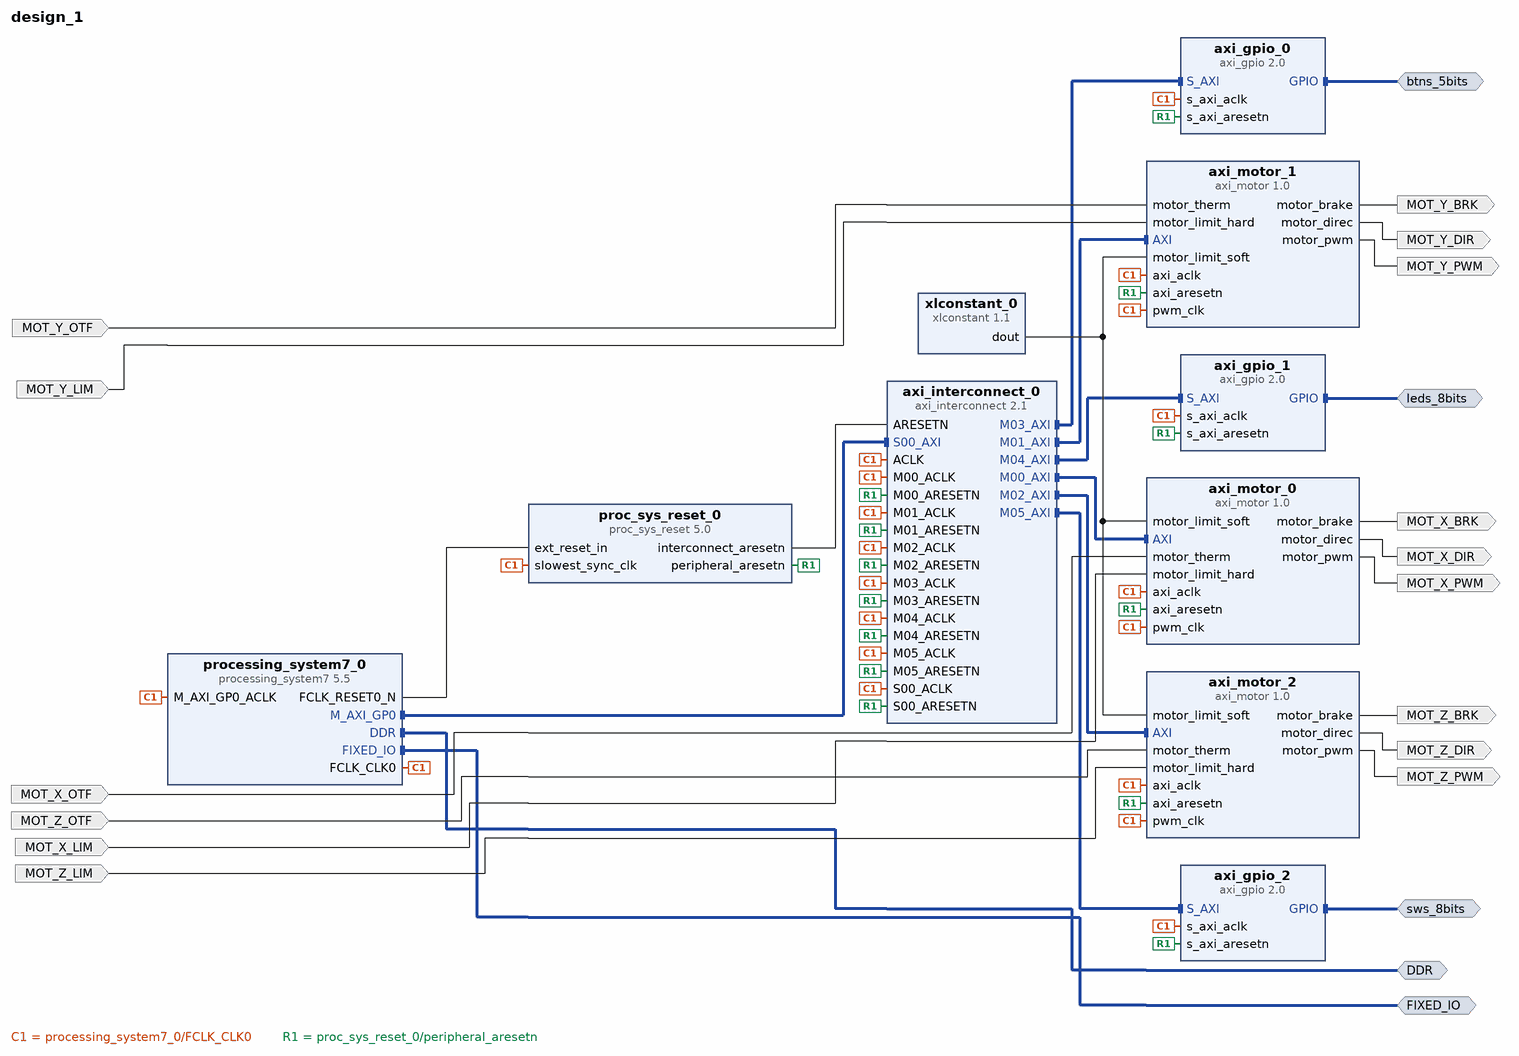
[diagram p0: block diagram of the top level]
# Vivado block design design_1, xc7z020clg484-1, Vivado 2017.2
create_bd_design design_1

create_bd_intf_port -mode Master -vlnv xilinx.com:interface:ddrx_rtl:1.0 DDR
create_bd_intf_port -mode Master -vlnv xilinx.com:display_processing_system7:fixedio_rtl:1.0 FIXED_IO
create_bd_intf_port -mode Master -vlnv xilinx.com:interface:gpio_rtl:1.0 btns_5bits
create_bd_intf_port -mode Master -vlnv xilinx.com:interface:gpio_rtl:1.0 leds_8bits
create_bd_intf_port -mode Master -vlnv xilinx.com:interface:gpio_rtl:1.0 sws_8bits
create_bd_port -dir O MOT_Y_PWM
create_bd_port -dir O MOT_Y_BRK
create_bd_port -dir O MOT_X_PWM
create_bd_port -dir O MOT_X_BRK
create_bd_port -dir O MOT_Z_PWM
create_bd_port -dir O MOT_Z_BRK
create_bd_port -dir I MOT_X_OTF
create_bd_port -dir I MOT_Y_OTF
create_bd_port -dir I MOT_Z_OTF
create_bd_port -dir O MOT_X_DIR
create_bd_port -dir O MOT_Y_DIR
create_bd_port -dir O MOT_Z_DIR
create_bd_port -dir I MOT_X_LIM
create_bd_port -dir I MOT_Y_LIM
create_bd_port -dir I MOT_Z_LIM

create_bd_cell -type ip -vlnv xilinx.com:ip:processing_system7:5.5 processing_system7_0
set_property -dict {CONFIG.preset ZedBoard} [get_bd_cells processing_system7_0]
create_bd_cell -type ip -vlnv xilinx.com:ip:proc_sys_reset:5.0 proc_sys_reset_0
create_bd_cell -type ip -vlnv xilinx.com:ip:axi_interconnect:2.1 axi_interconnect_0
set_property -dict {CONFIG.NUM_MI 6} [get_bd_cells axi_interconnect_0]
create_bd_cell -type ip -vlnv xilinx.com:ip:axi_gpio:2.0 axi_gpio_0
set_property -dict [list \
  CONFIG.C_IS_DUAL 0 \
  CONFIG.USE_BOARD_FLOW true \
  CONFIG.GPIO_BOARD_INTERFACE btns_5bits \
  CONFIG.GPIO2_BOARD_INTERFACE Custom \
] [get_bd_cells axi_gpio_0]
create_bd_cell -type ip -vlnv xilinx.com:ip:axi_gpio:2.0 axi_gpio_1
set_property -dict {CONFIG.USE_BOARD_FLOW true CONFIG.GPIO_BOARD_INTERFACE leds_8bits} [get_bd_cells axi_gpio_1]
create_bd_cell -type ip -vlnv xilinx.com:ip:axi_gpio:2.0 axi_gpio_2
set_property -dict {CONFIG.USE_BOARD_FLOW true CONFIG.GPIO_BOARD_INTERFACE sws_8bits} [get_bd_cells axi_gpio_2]
create_bd_cell -type ip -vlnv xilinx.com:ip:xlconstant:1.1 xlconstant_0
set_property -dict {CONFIG.CONST_VAL 0} [get_bd_cells xlconstant_0]
create_bd_cell -type ip -vlnv user.edu:Crane:axi_motor:1.0 axi_motor_0
set_property -dict {CONFIG.NUM_MOTOR_LIMIT_FLAGS 1} [get_bd_cells axi_motor_0]
create_bd_cell -type ip -vlnv user.edu:Crane:axi_motor:1.0 axi_motor_1
set_property -dict {CONFIG.NUM_MOTOR_LIMIT_FLAGS 1} [get_bd_cells axi_motor_1]
create_bd_cell -type ip -vlnv user.edu:Crane:axi_motor:1.0 axi_motor_2
set_property -dict {CONFIG.NUM_MOTOR_LIMIT_FLAGS 1} [get_bd_cells axi_motor_2]

# ---- connections ----

connect_bd_intf_net [get_bd_intf_pins processing_system7_0/M_AXI_GP0] [get_bd_intf_pins axi_interconnect_0/S00_AXI]
connect_bd_intf_net [get_bd_intf_pins axi_motor_0/AXI] [get_bd_intf_pins axi_interconnect_0/M00_AXI]
connect_bd_intf_net [get_bd_intf_pins axi_motor_1/AXI] [get_bd_intf_pins axi_interconnect_0/M01_AXI]
connect_bd_intf_net [get_bd_intf_pins axi_motor_2/AXI] [get_bd_intf_pins axi_interconnect_0/M02_AXI]
connect_bd_intf_net [get_bd_intf_pins axi_gpio_0/S_AXI] [get_bd_intf_pins axi_interconnect_0/M03_AXI]
connect_bd_intf_net [get_bd_intf_pins axi_gpio_1/S_AXI] [get_bd_intf_pins axi_interconnect_0/M04_AXI]
connect_bd_intf_net [get_bd_intf_pins axi_gpio_2/S_AXI] [get_bd_intf_pins axi_interconnect_0/M05_AXI]
connect_bd_intf_net [get_bd_intf_ports DDR] [get_bd_intf_pins processing_system7_0/DDR]
connect_bd_intf_net [get_bd_intf_ports FIXED_IO] [get_bd_intf_pins processing_system7_0/FIXED_IO]
connect_bd_intf_net [get_bd_intf_ports btns_5bits] [get_bd_intf_pins axi_gpio_0/GPIO]
connect_bd_intf_net [get_bd_intf_ports leds_8bits] [get_bd_intf_pins axi_gpio_1/GPIO]
connect_bd_intf_net [get_bd_intf_ports sws_8bits] [get_bd_intf_pins axi_gpio_2/GPIO]
connect_bd_net [get_bd_pins processing_system7_0/FCLK_CLK0] \
  [get_bd_pins proc_sys_reset_0/slowest_sync_clk] [get_bd_pins processing_system7_0/M_AXI_GP0_ACLK] \
  [get_bd_pins axi_gpio_0/s_axi_aclk] [get_bd_pins axi_gpio_1/s_axi_aclk] [get_bd_pins axi_gpio_2/s_axi_aclk] \
  [get_bd_pins axi_interconnect_0/ACLK] [get_bd_pins axi_interconnect_0/S00_ACLK] [get_bd_pins axi_interconnect_0/M00_ACLK] \
  [get_bd_pins axi_interconnect_0/M01_ACLK] [get_bd_pins axi_interconnect_0/M02_ACLK] \
  [get_bd_pins axi_interconnect_0/M03_ACLK] [get_bd_pins axi_interconnect_0/M04_ACLK] \
  [get_bd_pins axi_interconnect_0/M05_ACLK] [get_bd_pins axi_motor_0/pwm_clk] [get_bd_pins axi_motor_0/axi_aclk] \
  [get_bd_pins axi_motor_1/pwm_clk] [get_bd_pins axi_motor_1/axi_aclk] [get_bd_pins axi_motor_2/pwm_clk] \
  [get_bd_pins axi_motor_2/axi_aclk]
connect_bd_net [get_bd_pins proc_sys_reset_0/interconnect_aresetn] [get_bd_pins axi_interconnect_0/ARESETN]
connect_bd_net [get_bd_pins proc_sys_reset_0/peripheral_aresetn] \
  [get_bd_pins axi_gpio_0/s_axi_aresetn] [get_bd_pins axi_gpio_2/s_axi_aresetn] [get_bd_pins axi_gpio_1/s_axi_aresetn] \
  [get_bd_pins axi_interconnect_0/S00_ARESETN] [get_bd_pins axi_interconnect_0/M00_ARESETN] \
  [get_bd_pins axi_interconnect_0/M01_ARESETN] [get_bd_pins axi_interconnect_0/M02_ARESETN] \
  [get_bd_pins axi_interconnect_0/M03_ARESETN] [get_bd_pins axi_interconnect_0/M05_ARESETN] \
  [get_bd_pins axi_interconnect_0/M04_ARESETN] [get_bd_pins axi_motor_0/axi_aresetn] [get_bd_pins axi_motor_1/axi_aresetn] \
  [get_bd_pins axi_motor_2/axi_aresetn]
connect_bd_net [get_bd_pins processing_system7_0/FCLK_RESET0_N] [get_bd_pins proc_sys_reset_0/ext_reset_in]
connect_bd_net [get_bd_pins axi_motor_1/motor_pwm] [get_bd_ports MOT_Y_PWM]
connect_bd_net [get_bd_pins axi_motor_1/motor_brake] [get_bd_ports MOT_Y_BRK]
connect_bd_net [get_bd_pins axi_motor_0/motor_pwm] [get_bd_ports MOT_X_PWM]
connect_bd_net [get_bd_pins axi_motor_0/motor_brake] [get_bd_ports MOT_X_BRK]
connect_bd_net [get_bd_pins axi_motor_2/motor_pwm] [get_bd_ports MOT_Z_PWM]
connect_bd_net [get_bd_pins axi_motor_2/motor_brake] [get_bd_ports MOT_Z_BRK]
connect_bd_net -net motor_therm_1 [get_bd_ports MOT_X_OTF] [get_bd_pins axi_motor_0/motor_therm]
connect_bd_net -net motor_therm_2 [get_bd_ports MOT_Y_OTF] [get_bd_pins axi_motor_1/motor_therm]
connect_bd_net -net motor_therm_3 [get_bd_ports MOT_Z_OTF] [get_bd_pins axi_motor_2/motor_therm]
connect_bd_net [get_bd_pins axi_motor_0/motor_direc] [get_bd_ports MOT_X_DIR]
connect_bd_net [get_bd_pins axi_motor_1/motor_direc] [get_bd_ports MOT_Y_DIR]
connect_bd_net [get_bd_pins axi_motor_2/motor_direc] [get_bd_ports MOT_Z_DIR]
connect_bd_net -net motor_limit_hard_1 [get_bd_ports MOT_X_LIM] [get_bd_pins axi_motor_0/motor_limit_hard]
connect_bd_net -net motor_limit_hard_2 [get_bd_ports MOT_Y_LIM] [get_bd_pins axi_motor_1/motor_limit_hard]
connect_bd_net -net motor_limit_hard_3 [get_bd_ports MOT_Z_LIM] [get_bd_pins axi_motor_2/motor_limit_hard]
connect_bd_net [get_bd_pins xlconstant_0/dout] \
  [get_bd_pins axi_motor_0/motor_limit_soft] [get_bd_pins axi_motor_1/motor_limit_soft] \
  [get_bd_pins axi_motor_2/motor_limit_soft]

# ---- address map ----
assign_bd_address -offset 0x41200000 -range 64K -target_address_space [get_bd_addr_spaces processing_system7_0/Data] [get_bd_addr_segs axi_gpio_0/S_AXI/Reg]
assign_bd_address -offset 0x41210000 -range 64K -target_address_space [get_bd_addr_spaces processing_system7_0/Data] [get_bd_addr_segs axi_gpio_1/S_AXI/Reg]
assign_bd_address -offset 0x41220000 -range 64K -target_address_space [get_bd_addr_spaces processing_system7_0/Data] [get_bd_addr_segs axi_gpio_2/S_AXI/Reg]
assign_bd_address -offset 0x43C00000 -range 64K -target_address_space [get_bd_addr_spaces processing_system7_0/Data] [get_bd_addr_segs axi_motor_0/AXI/AXI_reg]
assign_bd_address -offset 0x43C10000 -range 64K -target_address_space [get_bd_addr_spaces processing_system7_0/Data] [get_bd_addr_segs axi_motor_1/AXI/AXI_reg]
assign_bd_address -offset 0x43C20000 -range 64K -target_address_space [get_bd_addr_spaces processing_system7_0/Data] [get_bd_addr_segs axi_motor_2/AXI/AXI_reg]

validate_bd_design
save_bd_design
